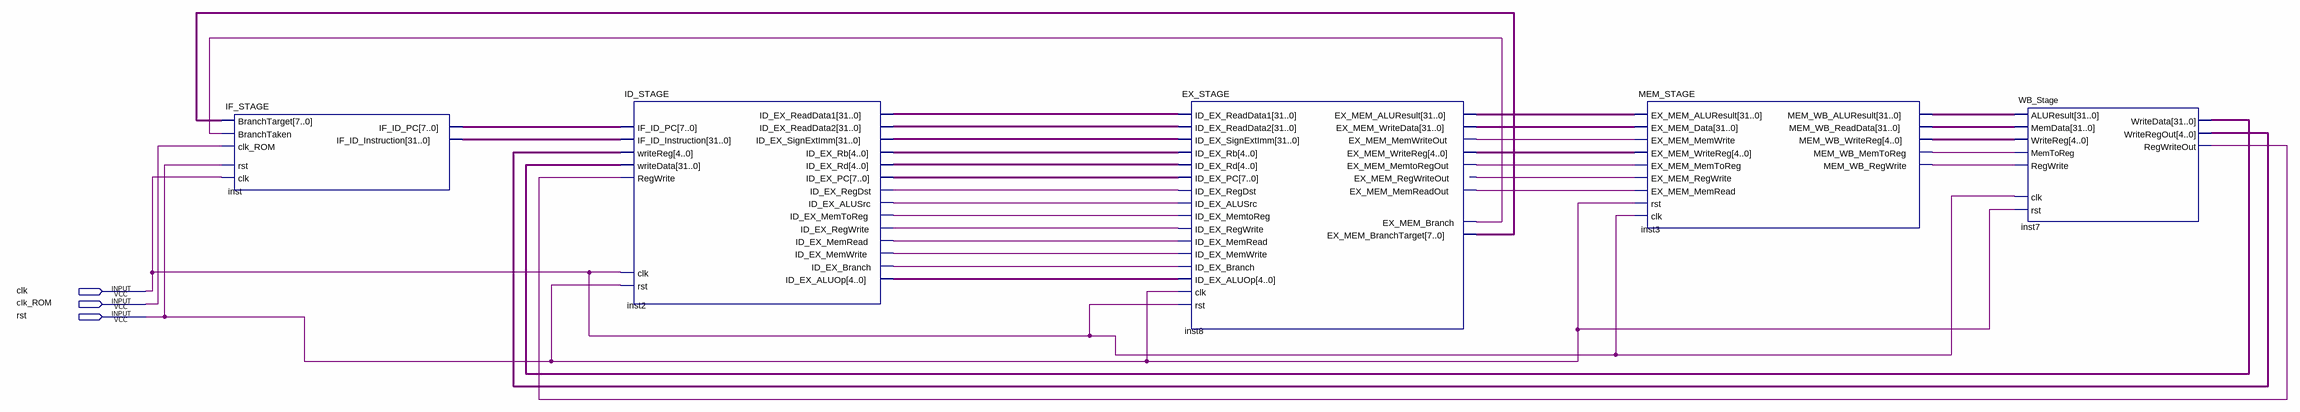
[diagram p0: schematic sheet]
// Quartus schematic Processador.bdf as structural Verilog: 5 symbols, 3 pins
module Processador (
  input  clk,
  input  clk_ROM,
  input  rst
);

  wire inst2_id_ex_alusrc, inst2_id_ex_branch, inst2_id_ex_memread, inst2_id_ex_memtoreg,
       inst2_id_ex_memwrite, inst2_id_ex_regdst, inst2_id_ex_regwrite, inst3_mem_wb_memtoreg,
       inst3_mem_wb_regwrite, inst7_regwriteout, inst8_ex_mem_branch, inst8_ex_mem_memreadout,
       inst8_ex_mem_memtoregout, inst8_ex_mem_memwriteout, inst8_ex_mem_regwriteout;
  wire [4:0] inst2_id_ex_aluop, inst2_id_ex_rb, inst2_id_ex_rd, inst3_mem_wb_writereg, inst7_writeregout,
       inst8_ex_mem_writereg;
  wire [7:0] inst2_id_ex_pc, inst8_ex_mem_branchtarget, inst_if_id_pc;
  wire [31:0] inst2_id_ex_readdata1, inst2_id_ex_readdata2, inst2_id_ex_signextimm, inst3_mem_wb_aluresult,
       inst3_mem_wb_readdata, inst7_writedata, inst8_ex_mem_aluresult, inst8_ex_mem_writedata,
       inst_if_id_instruction;

  IF_STAGE inst (
    .clk(clk), .rst(rst), .BranchTarget(inst8_ex_mem_branchtarget), .BranchTaken(inst8_ex_mem_branch),
    .clk_ROM(clk_ROM), .IF_ID_PC(inst_if_id_pc), .IF_ID_Instruction(inst_if_id_instruction));
  ID_STAGE inst2 (
    .clk(clk), .rst(rst), .IF_ID_Instruction(inst_if_id_instruction), .writeReg(inst7_writeregout),
    .writeData(inst7_writedata), .RegWrite(inst7_regwriteout), .IF_ID_PC(inst_if_id_pc),
    .ID_EX_ReadData1(inst2_id_ex_readdata1), .ID_EX_ReadData2(inst2_id_ex_readdata2),
    .ID_EX_SignExtImm(inst2_id_ex_signextimm), .ID_EX_Rb(inst2_id_ex_rb), .ID_EX_Rd(inst2_id_ex_rd),
    .ID_EX_PC(inst2_id_ex_pc), .ID_EX_RegDst(inst2_id_ex_regdst), .ID_EX_ALUSrc(inst2_id_ex_alusrc),
    .ID_EX_MemToReg(inst2_id_ex_memtoreg), .ID_EX_RegWrite(inst2_id_ex_regwrite),
    .ID_EX_MemRead(inst2_id_ex_memread), .ID_EX_MemWrite(inst2_id_ex_memwrite),
    .ID_EX_Branch(inst2_id_ex_branch), .ID_EX_ALUOp(inst2_id_ex_aluop));
  EX_STAGE inst8 (
    .ID_EX_ReadData1(inst2_id_ex_readdata1), .ID_EX_ReadData2(inst2_id_ex_readdata2),
    .ID_EX_SignExtImm(inst2_id_ex_signextimm), .ID_EX_Rb(inst2_id_ex_rb), .ID_EX_Rd(inst2_id_ex_rd),
    .ID_EX_PC(inst2_id_ex_pc), .ID_EX_RegDst(inst2_id_ex_regdst), .ID_EX_ALUSrc(inst2_id_ex_alusrc),
    .ID_EX_MemtoReg(inst2_id_ex_memtoreg), .ID_EX_RegWrite(inst2_id_ex_regwrite),
    .ID_EX_MemRead(inst2_id_ex_memread), .ID_EX_MemWrite(inst2_id_ex_memwrite),
    .ID_EX_Branch(inst2_id_ex_branch), .ID_EX_ALUOp(inst2_id_ex_aluop), .clk(rst), .rst(clk),
    .EX_MEM_RegWriteOut(inst8_ex_mem_regwriteout), .EX_MEM_MemtoRegOut(inst8_ex_mem_memtoregout),
    .EX_MEM_MemWriteOut(inst8_ex_mem_memwriteout), .EX_MEM_MemReadOut(inst8_ex_mem_memreadout),
    .EX_MEM_Branch(inst8_ex_mem_branch), .EX_MEM_WriteData(inst8_ex_mem_writedata),
    .EX_MEM_WriteReg(inst8_ex_mem_writereg), .EX_MEM_BranchTarget(inst8_ex_mem_branchtarget),
    .EX_MEM_ALUResult(inst8_ex_mem_aluresult));
  MEM_STAGE inst3 (
    .EX_MEM_ALUResult(inst8_ex_mem_aluresult), .EX_MEM_Data(inst8_ex_mem_writedata),
    .EX_MEM_MemWrite(inst8_ex_mem_memwriteout), .EX_MEM_WriteReg(inst8_ex_mem_writereg),
    .EX_MEM_MemToReg(inst8_ex_mem_memtoregout), .EX_MEM_RegWrite(inst8_ex_mem_regwriteout),
    .EX_MEM_MemRead(inst8_ex_mem_memreadout), .rst(rst), .clk(clk),
    .MEM_WB_ALUResult(inst3_mem_wb_aluresult), .MEM_WB_ReadData(inst3_mem_wb_readdata),
    .MEM_WB_WriteReg(inst3_mem_wb_writereg), .MEM_WB_MemToReg(inst3_mem_wb_memtoreg),
    .MEM_WB_RegWrite(inst3_mem_wb_regwrite));
  WB_Stage inst7 (
    .clk(clk), .rst(rst), .RegWrite(inst3_mem_wb_regwrite), .MemToReg(inst3_mem_wb_memtoreg),
    .WriteReg(inst3_mem_wb_writereg), .ALUResult(inst3_mem_wb_aluresult), .MemData(inst3_mem_wb_readdata),
    .WriteData(inst7_writedata), .WriteRegOut(inst7_writeregout), .RegWriteOut(inst7_regwriteout));
endmodule
